# Altium project AnglerV1.PrjPcb
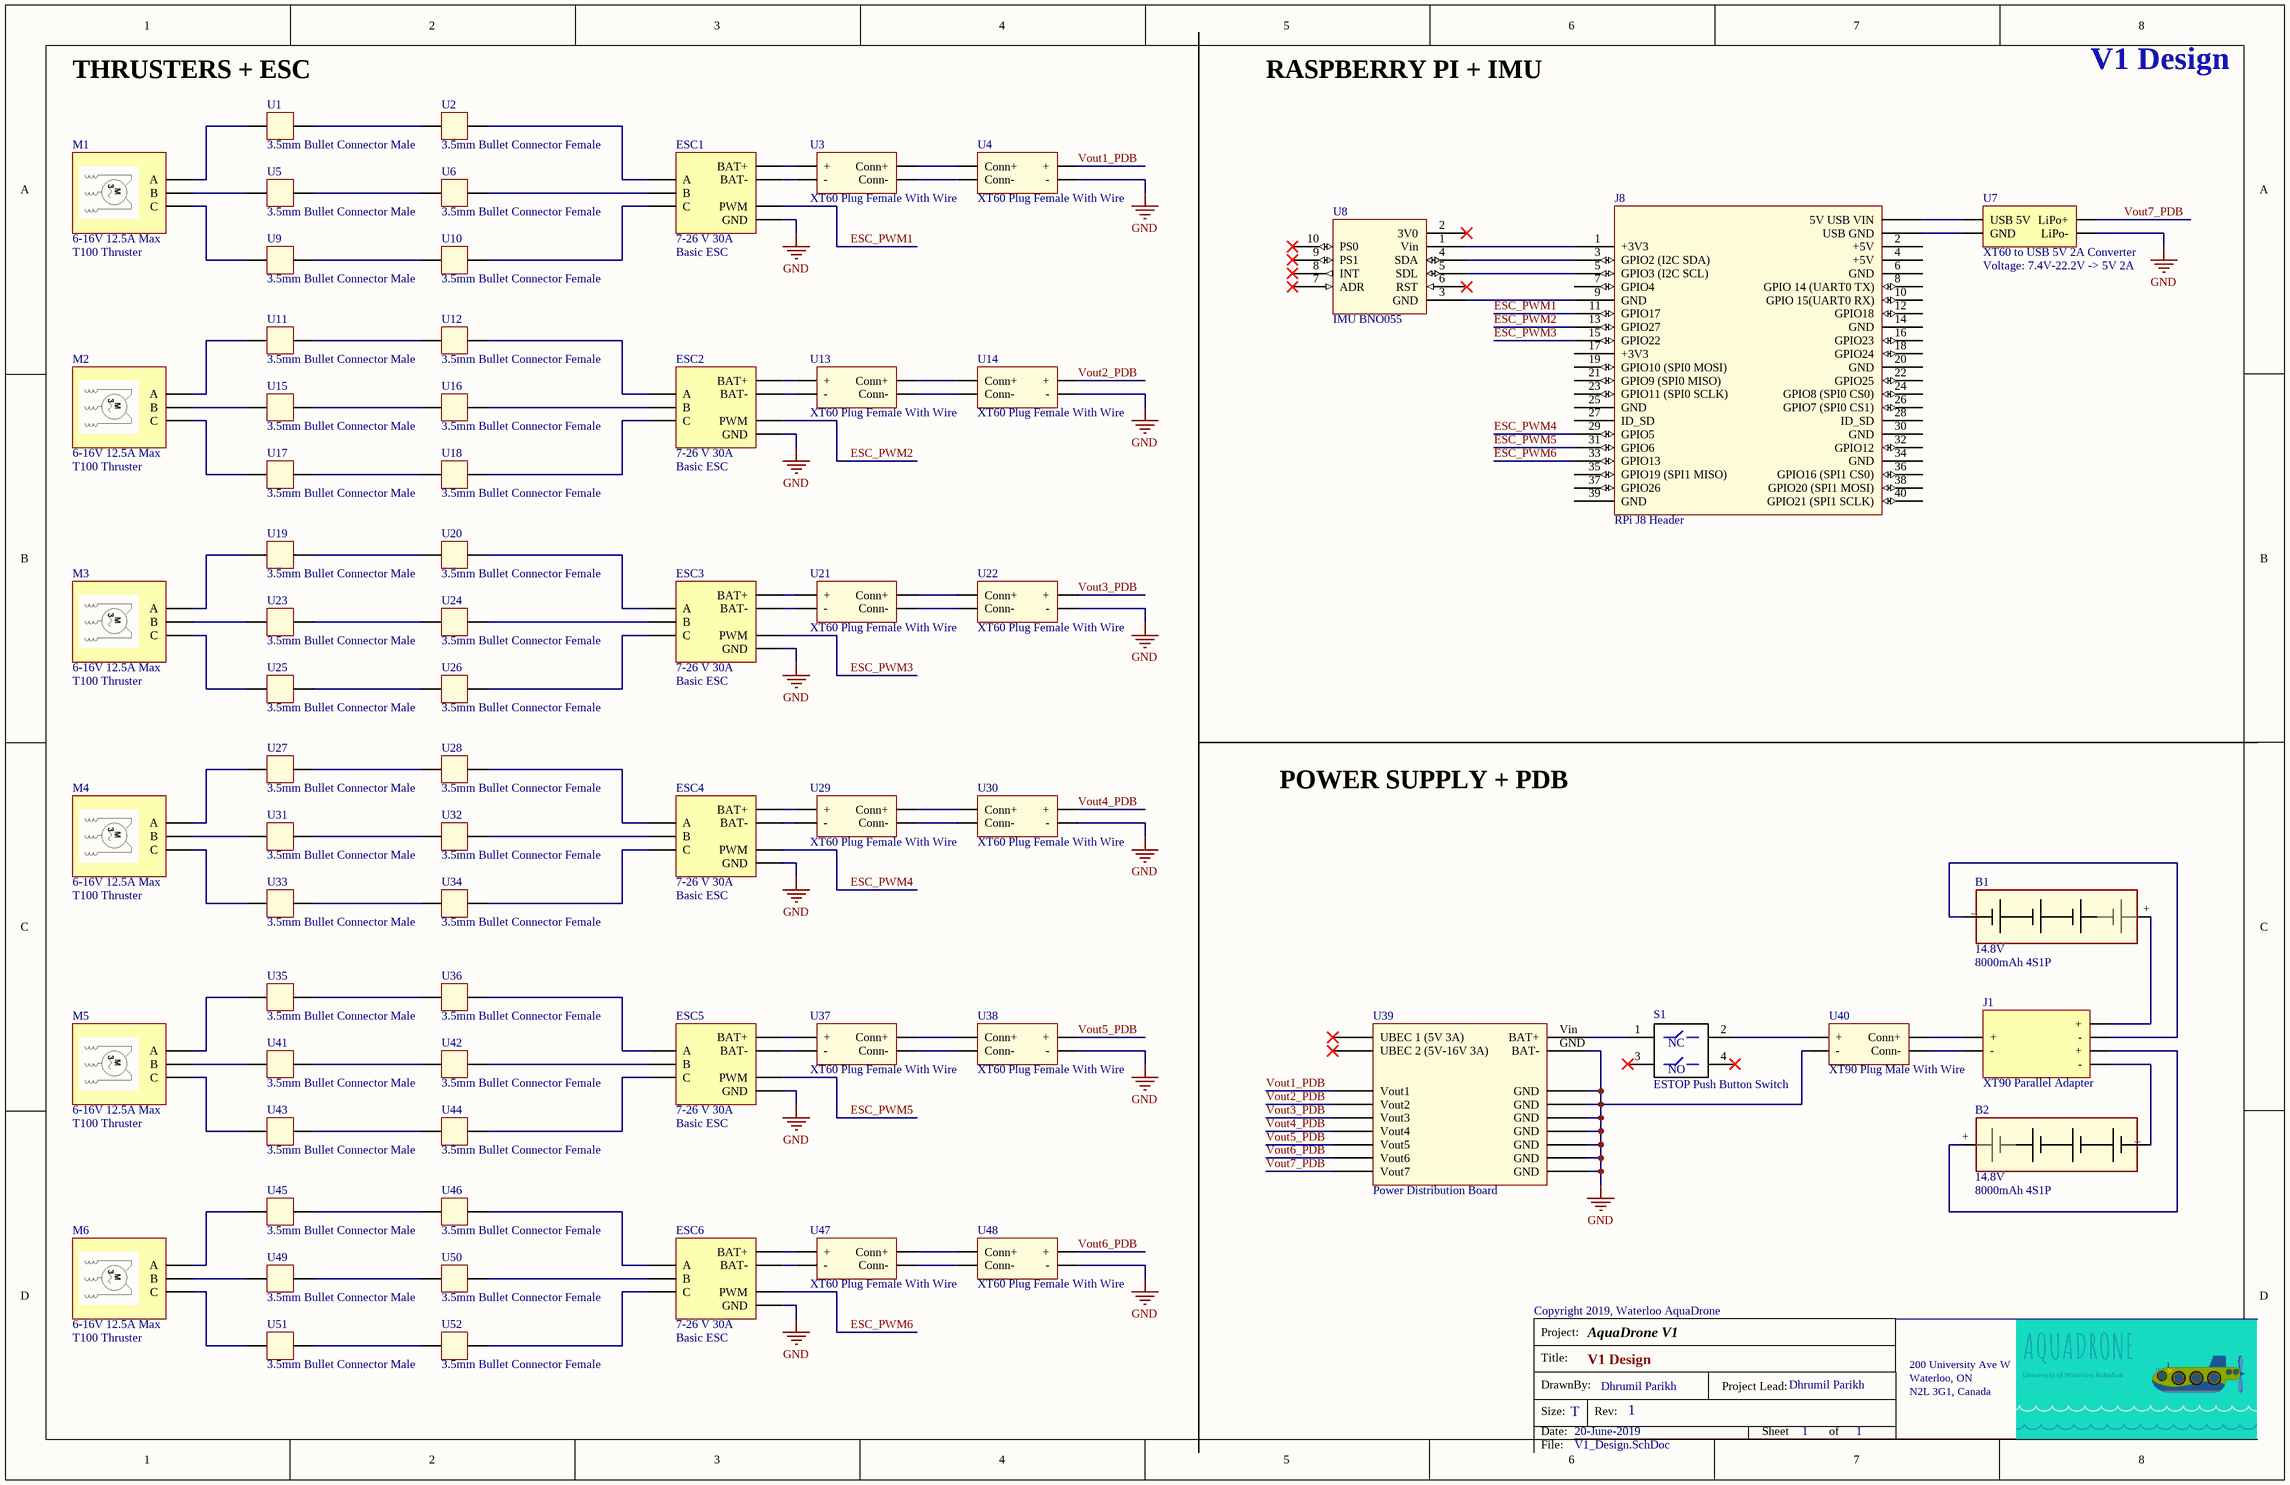
[diagram p0: V1_Design.SchDoc]
SheetTotal: 1; SchRevision: 1; SchNumber: V1; SchDrawnBy: Waterloo AquaDrone Electrical Team; SchDate: 20-June-2019; ProjectTitle: AquaDrone V1; ProjectLead: Dhrumil Parikh; PCBRevision: 1; PCBDate: 20-June-2019; PageSize: B; DrawnBy: Waterloo AquaDrone Electrical Team; Copyright: Copyright 2019, Waterloo AquaDrone
1 sheet, 69 parts. Net scope: global (net labels, ports and power ports of the same name join across sheets).

## Sheet V1_Design.SchDoc: V1 Design
size Tabloid; DrawnBy: Dhrumil Parikh; SheetNumber: 1; SheetTotal: 1; PageSetup: Record=PageOptions|CenterHorizontal=True|CenterVertical=True|PrintScale=0.62|XCorrection=1.00|YCorrection=1.00|PrintKind=1|BorderSize=5000000|LeftOffset=0|BottomOffset=0|Orientation=2|PaperLength=1000|PaperWidth=1000|Scale=100|PaperSource=7|PrintQuality=600|MediaType=1|DitherType=10|PaperKind=Letter|PrintScaleMode=1; PageSize: T

### Parts
B1  value 8000mAh 4S1P  VOLTAGE: 14.8V  (hidden comment: ZIPPY Flightmax 8000mAh 4S1P 30C w/ XT90)
B2  value 8000mAh 4S1P  VOLTAGE: 14.8V  (hidden comment: ZIPPY Flightmax 8000mAh 4S1P 30C w/ XT90)
ESC1  VOLTAGE: 7-26 V 30A  (hidden comment: Basic ESC)
ESC2  VOLTAGE: 7-26 V 30A  (hidden comment: Basic ESC)
ESC3  VOLTAGE: 7-26 V 30A  (hidden comment: Basic ESC)
ESC4  VOLTAGE: 7-26 V 30A  (hidden comment: Basic ESC)
ESC5  VOLTAGE: 7-26 V 30A  (hidden comment: Basic ESC)
ESC6  VOLTAGE: 7-26 V 30A  (hidden comment: Basic ESC)
J1  XT90 Parallel Adapter
J8  value RPi J8 Header  (hidden comment: RASPBERRY PI 3 MODEL B+)
M1  VOLTAGE: 6-16V 12.5A Max  (hidden comment: T100 Thruster)
M2  VOLTAGE: 6-16V 12.5A Max  (hidden comment: T100 Thruster)
M3  VOLTAGE: 6-16V 12.5A Max  (hidden comment: T100 Thruster)
M4  VOLTAGE: 6-16V 12.5A Max  (hidden comment: T100 Thruster)
M5  VOLTAGE: 6-16V 12.5A Max  (hidden comment: T100 Thruster)
M6  VOLTAGE: 6-16V 12.5A Max  (hidden comment: T100 Thruster)
S1  value ESTOP Push Button Switch  (hidden comment: ESTOP Switch)
U1  value 3.5mm Bullet Connector Male  (hidden comment: 3.5mm Bullet Banana Connector Male)
U2  value 3.5mm Bullet Connector Female  (hidden comment: 3.5mm Bullet Banana Connector Female)
U3  value XT60 Plug Female With Wire  (hidden comment: XT60 Plug Female)
U4  value XT60 Plug Female With Wire  (hidden comment: XT60 Plug Female)
U5  value 3.5mm Bullet Connector Male  (hidden comment: 3.5mm Bullet Banana Connector Male)
U6  value 3.5mm Bullet Connector Female  (hidden comment: 3.5mm Bullet Banana Connector Female)
U7  value XT60 to USB 5V 2A Converter  Voltage: 7.4V-22.2V -> 5V 2A  (hidden comment: Lipo Battery XT60 to USB 5V 2A Converter)
U8  value IMU BNO055  (hidden comment: BREAKOUT BOARD 9-DOF IMU BNO055)
U9  value 3.5mm Bullet Connector Male  (hidden comment: 3.5mm Bullet Banana Connector Male)
U10  value 3.5mm Bullet Connector Female  (hidden comment: 3.5mm Bullet Banana Connector Female)
U11  value 3.5mm Bullet Connector Male  (hidden comment: 3.5mm Bullet Banana Connector Male)
U12  value 3.5mm Bullet Connector Female  (hidden comment: 3.5mm Bullet Banana Connector Female)
U13  value XT60 Plug Female With Wire  (hidden comment: XT60 Plug Female)
U14  value XT60 Plug Female With Wire  (hidden comment: XT60 Plug Female)
U15  value 3.5mm Bullet Connector Male  (hidden comment: 3.5mm Bullet Banana Connector Male)
U16  value 3.5mm Bullet Connector Female  (hidden comment: 3.5mm Bullet Banana Connector Female)
U17  value 3.5mm Bullet Connector Male  (hidden comment: 3.5mm Bullet Banana Connector Male)
U18  value 3.5mm Bullet Connector Female  (hidden comment: 3.5mm Bullet Banana Connector Female)
U19  value 3.5mm Bullet Connector Male  (hidden comment: 3.5mm Bullet Banana Connector Male)
U20  value 3.5mm Bullet Connector Female  (hidden comment: 3.5mm Bullet Banana Connector Female)
U21  value XT60 Plug Female With Wire  (hidden comment: XT60 Plug Female)
U22  value XT60 Plug Female With Wire  (hidden comment: XT60 Plug Female)
U23  value 3.5mm Bullet Connector Male  (hidden comment: 3.5mm Bullet Banana Connector Male)
U24  value 3.5mm Bullet Connector Female  (hidden comment: 3.5mm Bullet Banana Connector Female)
U25  value 3.5mm Bullet Connector Male  (hidden comment: 3.5mm Bullet Banana Connector Male)
U26  value 3.5mm Bullet Connector Female  (hidden comment: 3.5mm Bullet Banana Connector Female)
U27  value 3.5mm Bullet Connector Male  (hidden comment: 3.5mm Bullet Banana Connector Male)
U28  value 3.5mm Bullet Connector Female  (hidden comment: 3.5mm Bullet Banana Connector Female)
U29  value XT60 Plug Female With Wire  (hidden comment: XT60 Plug Female)
U30  value XT60 Plug Female With Wire  (hidden comment: XT60 Plug Female)
U31  value 3.5mm Bullet Connector Male  (hidden comment: 3.5mm Bullet Banana Connector Male)
U32  value 3.5mm Bullet Connector Female  (hidden comment: 3.5mm Bullet Banana Connector Female)
U33  value 3.5mm Bullet Connector Male  (hidden comment: 3.5mm Bullet Banana Connector Male)
U34  value 3.5mm Bullet Connector Female  (hidden comment: 3.5mm Bullet Banana Connector Female)
U35  value 3.5mm Bullet Connector Male  (hidden comment: 3.5mm Bullet Banana Connector Male)
U36  value 3.5mm Bullet Connector Female  (hidden comment: 3.5mm Bullet Banana Connector Female)
U37  value XT60 Plug Female With Wire  (hidden comment: XT60 Plug Female)
U38  value XT60 Plug Female With Wire  (hidden comment: XT60 Plug Female)
U39  value Power Distribution Board  (hidden comment: PDB + 2 x UBEC)
U40  value XT90 Plug Male With Wire  (hidden comment: XT90 Plug Male)
U41  value 3.5mm Bullet Connector Male  (hidden comment: 3.5mm Bullet Banana Connector Male)
U42  value 3.5mm Bullet Connector Female  (hidden comment: 3.5mm Bullet Banana Connector Female)
U43  value 3.5mm Bullet Connector Male  (hidden comment: 3.5mm Bullet Banana Connector Male)
U44  value 3.5mm Bullet Connector Female  (hidden comment: 3.5mm Bullet Banana Connector Female)
U45  value 3.5mm Bullet Connector Male  (hidden comment: 3.5mm Bullet Banana Connector Male)
U46  value 3.5mm Bullet Connector Female  (hidden comment: 3.5mm Bullet Banana Connector Female)
U47  value XT60 Plug Female With Wire  (hidden comment: XT60 Plug Female)
U48  value XT60 Plug Female With Wire  (hidden comment: XT60 Plug Female)
U49  value 3.5mm Bullet Connector Male  (hidden comment: 3.5mm Bullet Banana Connector Male)
U50  value 3.5mm Bullet Connector Female  (hidden comment: 3.5mm Bullet Banana Connector Female)
U51  value 3.5mm Bullet Connector Male  (hidden comment: 3.5mm Bullet Banana Connector Male)
U52  value 3.5mm Bullet Connector Female  (hidden comment: 3.5mm Bullet Banana Connector Female)

### Nets
GND: ESC1.?7(GND) ESC2.?7(GND) ESC3.?7(GND) ESC4.?7(GND) ESC5.?7(GND) ESC6.?7(GND) U4.?2(-) U7.2(LiPo-) U14.?2(-) U22.?2(-) U30.?2(-) U38.?2(-) U39.?2(GND) U39.?4(GND) U39.?6(GND) U39.?10(GND) U39.?11(GND) U39.?15(GND) U39.?16(GND) U39.GND(BAT-) U40.?2(-) U48.?2(-)
ESC_PWM1: ESC1.?6(PWM) J8.11(GPIO17)
ESC_PWM2: ESC2.?6(PWM) J8.13(GPIO27)
ESC_PWM3: ESC3.?6(PWM) J8.15(GPIO22)
ESC_PWM4: ESC4.?6(PWM) J8.29(GPIO5)
ESC_PWM5: ESC5.?6(PWM) J8.31(GPIO6)
ESC_PWM6: ESC6.?6(PWM) J8.33(GPIO13)
Vout1_PDB: U4.?1(+) U39.?1(Vout1)
Vout2_PDB: U14.?1(+) U39.?3(Vout2)
Vout3_PDB: U22.?1(+) U39.?5(Vout3)
Vout4_PDB: U30.?1(+) U39.?9(Vout4)
Vout5_PDB: U38.?1(+) U39.?8(Vout5)
Vout6_PDB: U39.?7(Vout6) U48.?1(+)
Vout7_PDB: U7.1(LiPo+) U39.?12(Vout7)
NetB1_+: B1.+ J1.1(+)
NetB1__: B1._ J1.2(-)
NetB2_+: B2.+ J1.3(+)
NetB2__: B2._ J1.4(-)
NetESC1_?1: ESC1.?1(A) U2.?2
NetESC1_?2: ESC1.?2(B) U6.?2
NetESC1_?3: ESC1.?3(BAT+) U3.?1(+)
NetESC1_?4: ESC1.?4(BAT-) U3.?2(-)
NetESC1_?5: ESC1.?5(C) U10.?2
NetESC2_?1: ESC2.?1(A) U12.?2
NetESC2_?2: ESC2.?2(B) U16.?2
NetESC2_?3: ESC2.?3(BAT+) U13.?1(+)
NetESC2_?4: ESC2.?4(BAT-) U13.?2(-)
NetESC2_?5: ESC2.?5(C) U18.?2
NetESC3_?1: ESC3.?1(A) U20.?2
NetESC3_?2: ESC3.?2(B) U24.?2
NetESC3_?3: ESC3.?3(BAT+) U21.?1(+)
NetESC3_?4: ESC3.?4(BAT-) U21.?2(-)
NetESC3_?5: ESC3.?5(C) U26.?2
NetESC4_?1: ESC4.?1(A) U28.?2
NetESC4_?2: ESC4.?2(B) U32.?2
NetESC4_?3: ESC4.?3(BAT+) U29.?1(+)
NetESC4_?4: ESC4.?4(BAT-) U29.?2(-)
NetESC4_?5: ESC4.?5(C) U34.?2
NetESC5_?1: ESC5.?1(A) U36.?2
NetESC5_?2: ESC5.?2(B) U42.?2
NetESC5_?3: ESC5.?3(BAT+) U37.?1(+)
NetESC5_?4: ESC5.?4(BAT-) U37.?2(-)
NetESC5_?5: ESC5.?5(C) U44.?2
NetESC6_?1: ESC6.?1(A) U46.?2
NetESC6_?2: ESC6.?2(B) U50.?2
NetESC6_?3: ESC6.?3(BAT+) U47.?1(+)
NetESC6_?4: ESC6.?4(BAT-) U47.?2(-)
NetESC6_?5: ESC6.?5(C) U52.?2
NetJ1_2: J1.2(-) U40.?4(Conn-)
NetJ1_3: J1.3(+) U40.?3(Conn+)
NetJ8_1: J8.1(+3V3) U8.1(Vin)
NetJ8_3: J8.3(GPIO2_(I2C_SDA)) U8.4(SDA)
NetJ8_5: J8.5(GPIO3_(I2C_SCL)) U8.5(SDL)
NetJ8_9: J8.9(GND) U8.3(GND)
NetJ8_?1: J8.?1(5V_USB_VIN) U7.3(USB_5V)
NetJ8_?2: J8.?2(USB_GND) U7.2(GND)
NetM1_?1: M1.?1(A) U1.?1
NetM1_?2: M1.?2(B) U5.?1
NetM1_?3: M1.?3(C) U9.?1
NetM2_?1: M2.?1(A) U11.?1
NetM2_?2: M2.?2(B) U15.?1
NetM2_?3: M2.?3(C) U17.?1
NetM3_?1: M3.?1(A) U19.?1
NetM3_?2: M3.?2(B) U23.?1
NetM3_?3: M3.?3(C) U25.?1
NetM4_?1: M4.?1(A) U27.?1
NetM4_?2: M4.?2(B) U31.?1
NetM4_?3: M4.?3(C) U33.?1
NetM5_?1: M5.?1(A) U35.?1
NetM5_?2: M5.?2(B) U41.?1
NetM5_?3: M5.?3(C) U43.?1
NetM6_?1: M6.?1(A) U45.?1
NetM6_?2: M6.?2(B) U49.?1
NetM6_?3: M6.?3(C) U51.?1
NetS1_1: S1.1 U39.Vin(BAT+)
NetS1_2: S1.2 U40.?1(+)
NetU1_?2: U1.?2 U2.?1
NetU3_?3: U3.?3(Conn+) U4.?3(Conn+)
NetU3_?4: U3.?4(Conn-) U4.?4(Conn-)
NetU5_?2: U5.?2 U6.?1
NetU9_?2: U9.?2 U10.?1
NetU11_?2: U11.?2 U12.?1
NetU13_?3: U13.?3(Conn+) U14.?3(Conn+)
NetU13_?4: U13.?4(Conn-) U14.?4(Conn-)
NetU15_?2: U15.?2 U16.?1
NetU17_?2: U17.?2 U18.?1
NetU19_?2: U19.?2 U20.?1
NetU21_?3: U21.?3(Conn+) U22.?3(Conn+)
NetU21_?4: U21.?4(Conn-) U22.?4(Conn-)
NetU23_?2: U23.?2 U24.?1
NetU25_?2: U25.?2 U26.?1
NetU27_?2: U27.?2 U28.?1
NetU29_?3: U29.?3(Conn+) U30.?3(Conn+)
NetU29_?4: U29.?4(Conn-) U30.?4(Conn-)
NetU31_?2: U31.?2 U32.?1
NetU33_?2: U33.?2 U34.?1
NetU35_?2: U35.?2 U36.?1
NetU37_?3: U37.?3(Conn+) U38.?3(Conn+)
NetU37_?4: U37.?4(Conn-) U38.?4(Conn-)
NetU41_?2: U41.?2 U42.?1
NetU43_?2: U43.?2 U44.?1
NetU45_?2: U45.?2 U46.?1
NetU47_?3: U47.?3(Conn+) U48.?3(Conn+)
NetU47_?4: U47.?4(Conn-) U48.?4(Conn-)
NetU49_?2: U49.?2 U50.?1
NetU51_?2: U51.?2 U52.?1

Not connected (* = marked no-connect by the designer): J8 2(+5V) 4(+5V) 6(GND) 7(GPIO4) 8(GPIO_14_(UART0_TX)) 10(GPIO_15(UART0_RX)) 12(GPIO18) 14(GND) 16(GPIO23) 17(+3V3) 18(GPIO24) 19(GPIO10_(SPI0_MOSI)) 20(GND) 21(GPIO9_(SPI0_MISO)) 22(GPIO25) 23(GPIO11_(SPI0_SCLK)) 24(GPIO8_(SPI0_CS0)) 25(GND) 26(GPIO7_(SPI0_CS1)) 27(ID_SD) 28(ID_SD) 30(GND) 32(GPIO12) 34(GND) 35(GPIO19_(SPI1_MISO)) 36(GPIO16_(SPI1_CS0)) 37(GPIO26) 38(GPIO20_(SPI1_MOSI)) 39(GND) 40(GPIO21_(SPI1_SCLK)); S1 3* 4*; U8 2(3V0)* 6(RST)* 7(ADR)* 8(INT)* 9(PS1)* 10(PS0)*; U39 ?13(UBEC_1_(5V_3A))* ?14(UBEC_2_(5V-16V_3A))*

### Notes on the sheet
- (near U1) THRUSTERS + ESC
- RASPBERRY PI + IMU
- POWER SUPPLY + PDB
- Title:
- Project:
- 200 University Ave W
- Size:
- Date:
- DrawnBy:
- Rev:
- Project Lead:
- Sheet
- Dhrumil Parikh
- of
- Waterloo, ON
- N2L 3G1, Canada
- File:
- (in symbol ESTOP Switch) NC; NO

### Library data of the parts
B1 B2 = ZIPPY Flightmax 8000mAh 4S1P 30C w/ XT90: MFG_PART_NO: 9067000298; COST1K: 70; MFG: hobbyking; ROHS: Y
ESC1-ESC6 = Basic ESC: MFG_PART_NO: BESC30-R3; COST1K: 25; MFG: Blue Robotics; ROHS: Y; VALUE: Basic ESC
J1 = XT90 Parallel Adapter: MFG_PART_NO: 015000144; COST1K: 3.56; MFG: hobbyking; ROHS: Y; VALUE: XT90 Parallel Adapter
J8 = RASPBERRY PI 3 MODEL B+: COST1K: 60; MFG: Raspberry Pi; MFG_PART_NO: RASPBERRY PI 3 MODEL B+; ROHS: Y
M1-M6 = T100 Thruster: COST1K: 119; MFG: Blue Robotics; MFG_PART_NO: T100; ROHS: Y; VALUE: T100 Thruster
S1 = ESTOP Switch: MFG_PART_NO: a14041700ux0692; COST1K: 12; MFG: uxell; ROHS: Y
U1 U5 U9 U11 U15 U17 U19 U23 U25 U27 U31 U33 U35 U41 U43 U45 U49 U51 = 3.5mm Bullet Banana Connector Male: MFG_PART_NO: B07H3H7Q68; COST1K: 11.50; MFG: ROBOJAX; ROHS: Y
U2 U6 U10 U12 U16 U18 U20 U24 U26 U28 U32 U34 U36 U42 U44 U46 U50 U52 = 3.5mm Bullet Banana Connector Female: MFG_PART_NO: B07H3H7Q68; COST1K: 11.50; MFG: ROBOJAX; ROHS: Y
U3 U4 U13 U14 U21 U22 U29 U30 U37 U38 U47 U48 = XT60 Plug Female: MFG_PART_NO: 015000064; COST1K: 5.57; MFG: hobbyking; ROHS: Y
U7 = Lipo Battery XT60 to USB 5V 2A Converter: MFG_PART_NO: 015000144; COST1K: 27; MFG: LHI; ROHS: Y
U8 = BREAKOUT BOARD 9-DOF IMU BNO055: COST1K: 50; MFG: Adafruit Industries LLC; MFG_PART_NO: BNO055; ROHS: Y
U39 = PDB + 2 x UBEC: MFG_PART_NO: 747000004; COST1K: 13.75; MFG: hobbyking; ROHS: Y
U40 = XT90 Plug Male: MFG_PART_NO: 015000064; COST1K: 7.28; MFG: hobbyking; ROHS: Y